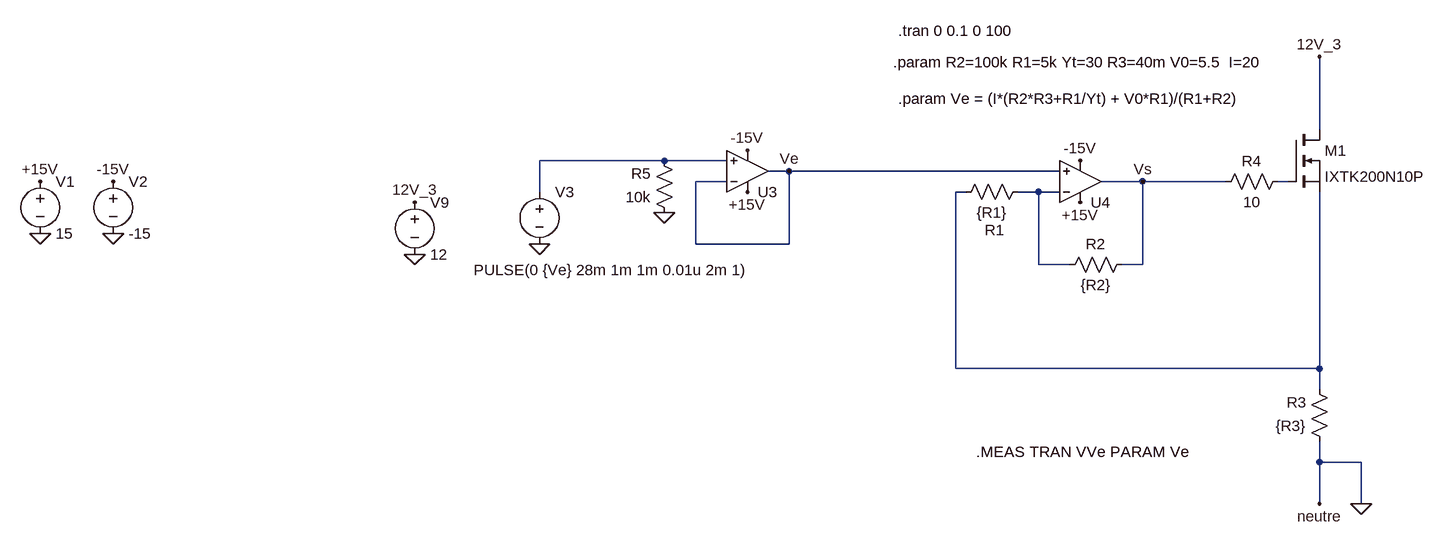
[diagram p0: schematic pilotage_mosfet.asc]
pilotage_mosfet.asc, the LTspice schematic file:
Version 4
SHEET 1 3180 1656
WIRE -864 -80 -864 -192
WIRE -1872 -32 -2064 -32
WIRE -1776 -32 -1872 -32
WIRE -1680 -16 -1712 -16
WIRE -1264 -16 -1680 -16
WIRE -1776 0 -1824 0
WIRE -1136 0 -1200 0
WIRE -1008 0 -1136 0
WIRE -912 0 -928 0
WIRE -2064 16 -2064 -32
WIRE -1744 16 -1744 0
WIRE -1408 16 -1424 16
WIRE -1296 16 -1328 16
WIRE -1264 16 -1296 16
WIRE -1232 32 -1232 16
WIRE -1824 96 -1824 0
WIRE -1680 96 -1680 -16
WIRE -1680 96 -1824 96
WIRE -1296 128 -1296 16
WIRE -1248 128 -1296 128
WIRE -1136 128 -1136 0
WIRE -1136 128 -1168 128
WIRE -1424 288 -1424 16
WIRE -864 288 -864 16
WIRE -864 288 -1424 288
WIRE -864 320 -864 288
WIRE -864 432 -864 400
WIRE -800 432 -864 432
WIRE -864 496 -864 432
WIRE -800 496 -800 432
FLAG -2832 80 0
FLAG -2720 80 0
FLAG -2832 0 +15V
FLAG -2720 0 -15V
FLAG -2064 96 0
FLAG -1872 48 0
FLAG -864 496 neutre
FLAG -800 496 0
FLAG -2256 112 0
FLAG -2256 32 12V_3
FLAG -864 -192 12V_3
FLAG -1744 16 +15V
FLAG -1232 32 +15V
FLAG -1744 -48 -15V
FLAG -1232 -32 -15V
FLAG -1136 0 Vs
FLAG -1680 -16 Ve
SYMBOL nmos -912 -80 R0
SYMATTR InstName M1
SYMATTR Value IXTK200N10P
SYMBOL res -848 416 R180
WINDOW 0 36 76 Left 2
WINDOW 3 36 40 Left 2
SYMATTR InstName R3
SYMATTR Value {R3}
SYMBOL voltage -2832 -16 R0
WINDOW 123 0 0 Left 2
WINDOW 39 0 0 Left 2
SYMATTR InstName V1
SYMATTR Value 15
SYMBOL voltage -2720 -16 R0
WINDOW 123 0 0 Left 2
WINDOW 39 0 0 Left 2
SYMATTR InstName V2
SYMATTR Value -15
SYMBOL voltage -2064 0 R0
WINDOW 123 0 0 Left 2
WINDOW 39 0 0 Left 2
WINDOW 3 -101 136 Left 2
SYMATTR Value PULSE(0 {Ve} 28m 1m 1m 0.01u 2m 1)
SYMATTR InstName V3
SYMBOL res -912 -16 R90
WINDOW 0 0 56 VBottom 2
WINDOW 3 32 56 VTop 2
SYMATTR InstName R4
SYMATTR Value 10
SYMBOL res -1152 112 R90
WINDOW 0 0 56 VBottom 2
WINDOW 3 32 56 VTop 2
SYMATTR InstName R2
SYMATTR Value {R2}
SYMBOL res -1312 0 R90
WINDOW 0 90 52 VBottom 2
WINDOW 3 32 56 VTop 2
SYMATTR InstName R1
SYMATTR Value {R1}
SYMBOL res -1856 64 R180
WINDOW 0 36 76 Left 2
WINDOW 3 36 40 Left 2
SYMATTR InstName R5
SYMATTR Value 10k
SYMBOL voltage -2256 16 R0
WINDOW 123 0 0 Left 2
WINDOW 39 0 0 Left 2
SYMATTR InstName V9
SYMATTR Value 12
SYMBOL Opamps\\UniversalOpamp2 -1744 -16 M180
SYMATTR InstName U3
SYMBOL Opamps\\UniversalOpamp2 -1232 0 M180
SYMATTR InstName U4
TEXT -1512 -232 Left 2 !.tran 0 0.1 0 100
TEXT -1520 -184 Left 2 !.param R2=100k R1=5k Yt=30 R3=40m V0=5.5  I=20
TEXT -1512 -128 Left 2 !.param Ve = (I*(R2*R3+R1/Yt) + V0*R1)/(R1+R2)
TEXT -1392 416 Left 2 !.MEAS TRAN VVe PARAM Ve

The netlist it stands for:
* pilotage_mosfet.asc
M1 12V_3 N002 N003 N003 IXTK200N10P
R3 0 N003 {R3}
V1 +15V 0 15
V2 -15V 0 -15
V3 N001 0 PULSE(0 {Ve} 28m 1m 1m 0.01u 2m 1)
R4 N002 Vs 10
R2 Vs N004 {R2}
R1 N004 N003 {R1}
R5 0 N001 10k
V9 12V_3 0 12
XU3 N001 Ve +15V -15V Ve level.2 Avol=1Meg GBW=10Meg Slew=10Meg ilimit=25m rail=0 Vos=0 phimargin=45 en=0 enk=0 in=0 ink=0 Rin=500Meg  ; pins IN+ IN- V+ V- OUT
XU4 Ve N004 +15V -15V Vs level.2 Avol=1Meg GBW=10Meg Slew=10Meg ilimit=25m rail=0 Vos=0 phimargin=45 en=0 enk=0 in=0 ink=0 Rin=500Meg  ; pins IN+ IN- V+ V- OUT
.model NMOS NMOS
.model PMOS PMOS
.lib standard.mos
.tran 0 0.1 0 100
.param R2=100k R1=5k Yt=30 R3=40m V0=5.5  I=20
.param Ve = (I*(R2*R3+R1/Yt) + V0*R1)/(R1+R2)
.MEAS TRAN VVe PARAM Ve
.lib UniversalOpamps2.sub
.backanno
.end